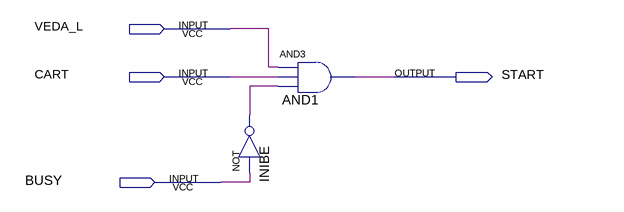
[diagram p0: schematic sheet]
// Quartus schematic Valida.bdf as structural Verilog: 2 symbols, 4 pins
module Valida (
  input  VEDA_L,
  input  CART,
  input  BUSY,
  output START
);

  wire INIBE_out;

  not INIBE (INIBE_out, BUSY);
  and AND1 (START, VEDA_L, CART, INIBE_out);
endmodule
